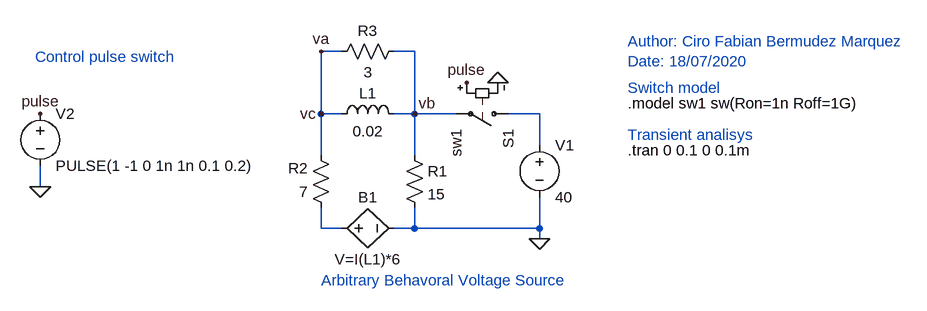
[diagram p0: schematic dependant_source_exercise.asc]
dependant_source_exercise.asc, the LTspice schematic file:
Version 4
SHEET 1 988 680
WIRE 16 -32 -16 -32
WIRE 128 -32 96 -32
WIRE -16 64 -16 -32
WIRE 16 64 -16 64
WIRE 128 64 128 -32
WIRE 128 64 96 64
WIRE 192 64 128 64
WIRE 320 64 272 64
WIRE 320 112 320 64
WIRE -16 128 -16 64
WIRE 128 128 128 64
WIRE -448 176 -448 144
WIRE -16 240 -16 208
WIRE 16 240 -16 240
WIRE 128 240 128 208
WIRE 128 240 96 240
WIRE 320 240 320 192
WIRE 320 240 128 240
WIRE 320 256 320 240
FLAG -16 -32 va
FLAG 320 256 0
FLAG -448 176 0
FLAG 256 16 0
FLAG 208 16 pulse
FLAG -448 64 pulse
FLAG 128 64 vb
FLAG -16 64 vc
SYMBOL res 112 112 R0
SYMATTR InstName R1
SYMATTR Value 15
SYMBOL res 0 224 R180
WINDOW 0 36 76 Left 2
WINDOW 3 36 40 Left 2
SYMATTR InstName R2
SYMATTR Value 7
SYMBOL res 0 -16 R270
WINDOW 0 32 56 VTop 2
WINDOW 3 0 56 VBottom 2
SYMATTR InstName R3
SYMATTR Value 3
SYMBOL ind 0 80 R270
WINDOW 0 32 56 VTop 2
WINDOW 3 5 56 VBottom 2
SYMATTR InstName L1
SYMATTR Value 0.02
SYMBOL voltage 320 96 R0
WINDOW 123 0 0 Left 0
WINDOW 39 0 0 Left 0
SYMATTR InstName V1
SYMATTR Value 40
SYMBOL sw 288 64 R90
SYMATTR InstName S1
SYMATTR Value sw1
SYMBOL voltage -448 48 R0
WINDOW 123 0 0 Left 0
WINDOW 39 0 0 Left 0
SYMATTR InstName V2
SYMATTR Value PULSE(1 -1 0 1n 1n 0.1 0.2)
SYMBOL bv 0 240 R270
WINDOW 0 32 56 VTop 2
WINDOW 3 -32 56 VBottom 2
SYMATTR InstName B1
SYMATTR Value V=I(L1)*6
TEXT 456 48 Left 2 !.model sw1 sw(Ron=1n Roff=1G)
TEXT 456 120 Left 2 !.tran 0 0.1 0 0.1m
TEXT 456 96 Left 2 ;Transient analisys
TEXT 456 -48 Left 2 ;Author: Ciro Fabian Bermudez Marquez\nDate: 18/07/2020
TEXT 456 24 Left 2 ;Switch model
TEXT -16 320 Left 2 ;Arbitrary Behavoral Voltage Source
TEXT -456 -24 Left 2 ;Control pulse switch

The netlist it stands for:
* dependant_source_exercise.asc
R1 vb 0 15
R2 N002 vc 7
R3 vc vb 3
L1 vc vb 0.02
V1 N001 0 40
S1 N001 vb pulse 0 sw1
V2 pulse 0 PULSE(1 -1 0 1n 1n 0.1 0.2)
B1 N002 0 V=I(L1)*6
.model sw1 sw(Ron=1n Roff=1G)
.tran 0 0.1 0 0.1m
* Transient analisys
* Author: Ciro Fabian Bermudez Marquez
* Date: 18/07/2020
* Switch model
* Arbitrary Behavoral Voltage Source
* Control pulse switch
.backanno
.end